# EAGLE schematic foxBMS_BMS-Slave (EAGLE 6.5.0), part 2 of 2
## Sheet 16 of 18: Connectors
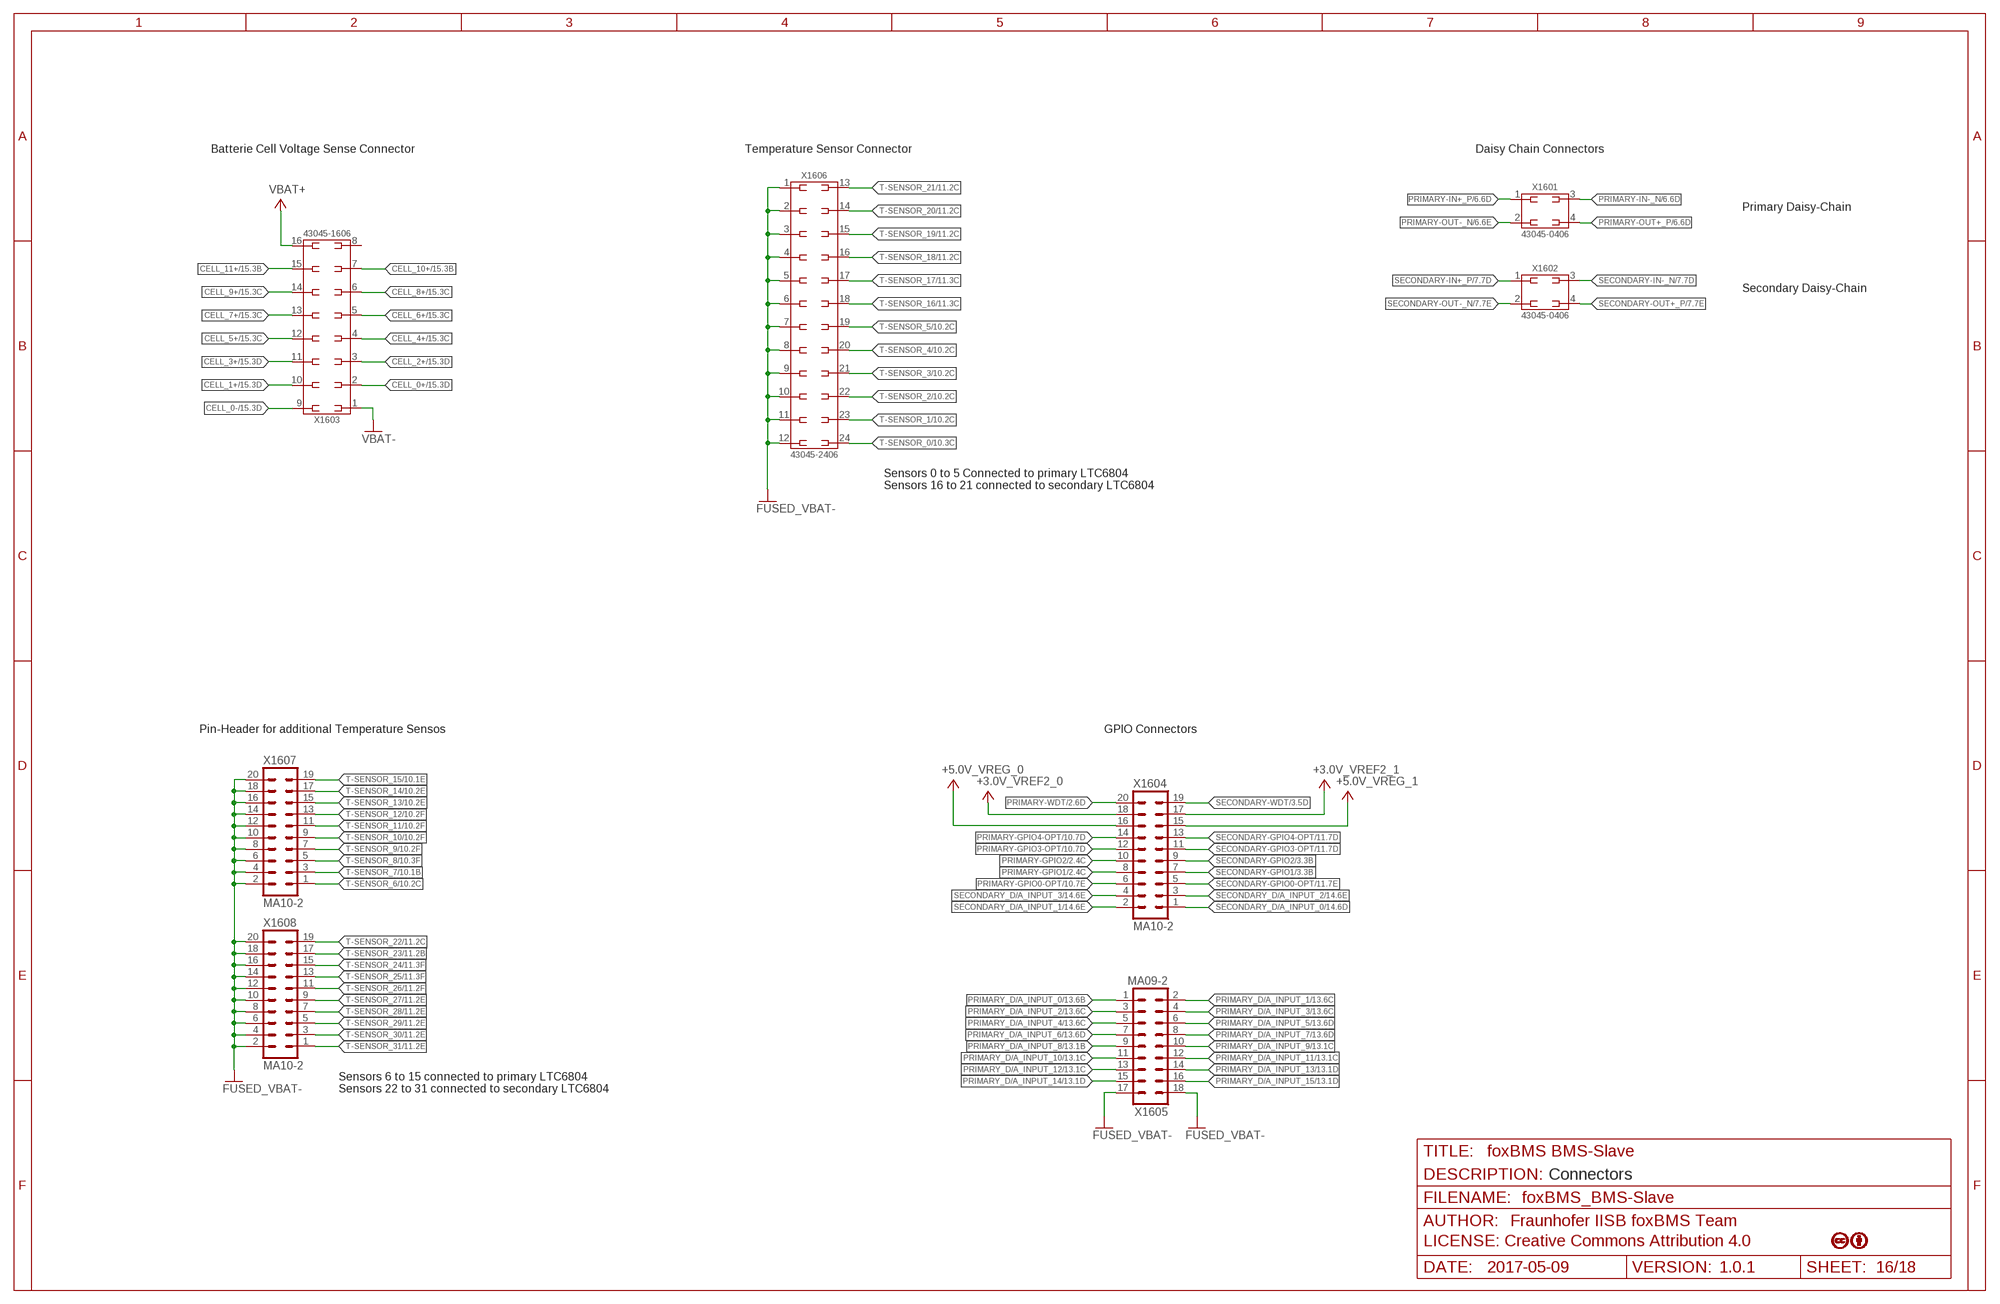
[diagram p16: schematic, sheet 16]

### Parts
X1601  43045-0406_MOLEX_4PIN  [X_SMD_MOLEX_43045-0408_R_REV01]
X1602  43045-0406_MOLEX_4PIN  [X_SMD_MOLEX_43045-0408_R_REV01]
X1603  43045-1606_MOLEX_16PIN  [X_SMD_MOLEX_43045-1608_R_REV01]
X1604  MA10-2  [MA10-2]
X1605  MA09-2  [MA09-2]
X1606  43045-2406_MOLEX_24PIN  [X_SMD_MOLEX_43045-2408_R_REV01]
X1607  MA10-2  [MA10-2]
X1608  MA10-2  [MA10-2]

### Nets
+3.0V_VREF2_0: X1604.18 ; also sheet 2,4,10
+3.0V_VREF2_1: X1604.17 ; also sheet 3,5,11
+5.0V_VREG_0: X1604.16 ; also sheet 2,4,6,10,13,17
+5.0V_VREG_1: X1604.15 ; also sheet 3,5,7,11,14,18
CELL_0+: X1603.2 ; also sheet 15
CELL_0-: X1603.9 ; also sheet 15
CELL_1+: X1603.10 ; also sheet 15
CELL_2+: X1603.3 ; also sheet 15
CELL_3+: X1603.11 ; also sheet 15
CELL_4+: X1603.4 ; also sheet 15
CELL_5+: X1603.12 ; also sheet 15
CELL_6+: X1603.5 ; also sheet 15
CELL_7+: X1603.13 ; also sheet 15
CELL_8+: X1603.6 ; also sheet 15
CELL_9+: X1603.14 ; also sheet 15
CELL_10+: X1603.7 ; also sheet 15
CELL_11+: X1603.15 ; also sheet 15
FUSED_VBAT-: X1605.17 X1605.18 X1606.1 X1606.2 X1606.3 X1606.4 X1606.5 X1606.6 X1606.7 X1606.8 X1606.9 X1606.10 X1606.11 X1606.12 X1607.2 X1607.4 X1607.6 X1607.8 X1607.10 X1607.12 X1607.14 X1607.16 X1607.18 X1607.20 X1608.2 X1608.4 X1608.6 X1608.8 X1608.10 X1608.12 X1608.14 X1608.16 X1608.18 X1608.20 ; also sheet 2,3,4,5,6,7,8,9,10,11,12,13,14,15,17,18
PRIMARY-GPIO0-OPT: X1604.6 ; also sheet 10
PRIMARY-GPIO1: X1604.8 ; also sheet 2
PRIMARY-GPIO2: X1604.10 ; also sheet 2,10
PRIMARY-GPIO3-OPT: X1604.12 ; also sheet 10
PRIMARY-GPIO4-OPT: X1604.14 ; also sheet 10
PRIMARY-IN+_P: X1601.1 ; also sheet 6
PRIMARY-IN-_N: X1601.3 ; also sheet 6
PRIMARY-OUT+_P: X1601.4 ; also sheet 6
PRIMARY-OUT-_N: X1601.2 ; also sheet 6
PRIMARY-WDT: X1604.20 ; also sheet 2,6
PRIMARY_D/A_INPUT_0: X1605.1 ; also sheet 13
PRIMARY_D/A_INPUT_1: X1605.2 ; also sheet 13
PRIMARY_D/A_INPUT_2: X1605.3 ; also sheet 13
PRIMARY_D/A_INPUT_3: X1605.4 ; also sheet 13
PRIMARY_D/A_INPUT_4: X1605.5 ; also sheet 13
PRIMARY_D/A_INPUT_5: X1605.6 ; also sheet 13
PRIMARY_D/A_INPUT_6: X1605.7 ; also sheet 13
PRIMARY_D/A_INPUT_7: X1605.8 ; also sheet 13
PRIMARY_D/A_INPUT_8: X1605.9 ; also sheet 13
PRIMARY_D/A_INPUT_9: X1605.10 ; also sheet 13
PRIMARY_D/A_INPUT_10: X1605.11 ; also sheet 13
PRIMARY_D/A_INPUT_11: X1605.12 ; also sheet 13
PRIMARY_D/A_INPUT_12: X1605.13 ; also sheet 13
PRIMARY_D/A_INPUT_13: X1605.14 ; also sheet 13
PRIMARY_D/A_INPUT_14: X1605.15 ; also sheet 13
PRIMARY_D/A_INPUT_15: X1605.16 ; also sheet 13
SECONDARY-GPIO0-OPT: X1604.5 ; also sheet 11
SECONDARY-GPIO1: X1604.7 ; also sheet 3
SECONDARY-GPIO2: X1604.9 ; also sheet 3,11
SECONDARY-GPIO3-OPT: X1604.11 ; also sheet 11
SECONDARY-GPIO4-OPT: X1604.13 ; also sheet 11
SECONDARY-IN+_P: X1602.1 ; also sheet 7
SECONDARY-IN-_N: X1602.3 ; also sheet 7
SECONDARY-OUT+_P: X1602.4 ; also sheet 7
SECONDARY-OUT-_N: X1602.2 ; also sheet 7
SECONDARY-WDT: X1604.19 ; also sheet 3,7
SECONDARY_D/A_INPUT_0: X1604.1 ; also sheet 14
SECONDARY_D/A_INPUT_1: X1604.2 ; also sheet 14
SECONDARY_D/A_INPUT_2: X1604.3 ; also sheet 14
SECONDARY_D/A_INPUT_3: X1604.4 ; also sheet 14
T-SENSOR_0: X1606.24 ; also sheet 10
T-SENSOR_1: X1606.23 ; also sheet 10
T-SENSOR_2: X1606.22 ; also sheet 10
T-SENSOR_3: X1606.21 ; also sheet 10
T-SENSOR_4: X1606.20 ; also sheet 10
T-SENSOR_5: X1606.19 ; also sheet 10
T-SENSOR_6: X1607.1 ; also sheet 10
T-SENSOR_7: X1607.3 ; also sheet 10
T-SENSOR_8: X1607.5 ; also sheet 10
T-SENSOR_9: X1607.7 ; also sheet 10
T-SENSOR_10: X1607.9 ; also sheet 10
T-SENSOR_11: X1607.11 ; also sheet 10
T-SENSOR_12: X1607.13 ; also sheet 10
T-SENSOR_13: X1607.15 ; also sheet 10
T-SENSOR_14: X1607.17 ; also sheet 10
T-SENSOR_15: X1607.19 ; also sheet 10
T-SENSOR_16: X1606.18 ; also sheet 11
T-SENSOR_17: X1606.17 ; also sheet 11
T-SENSOR_18: X1606.16 ; also sheet 11
T-SENSOR_19: X1606.15 ; also sheet 11
T-SENSOR_20: X1606.14 ; also sheet 11
T-SENSOR_21: X1606.13 ; also sheet 11
T-SENSOR_22: X1608.19 ; also sheet 11
T-SENSOR_23: X1608.17 ; also sheet 11
T-SENSOR_24: X1608.15 ; also sheet 11
T-SENSOR_25: X1608.13 ; also sheet 11
T-SENSOR_26: X1608.11 ; also sheet 11
T-SENSOR_27: X1608.9 ; also sheet 11
T-SENSOR_28: X1608.7 ; also sheet 11
T-SENSOR_29: X1608.5 ; also sheet 11
T-SENSOR_30: X1608.3 ; also sheet 11
T-SENSOR_31: X1608.1 ; also sheet 11
VBAT+: X1603.16 ; also sheet 15
VBAT-: X1603.1 ; also sheet 15
Unconnected: X1603.8

### Notes on the sheet
- Batterie Cell Voltage Sense Connector | Temperature Sensor Connector | Daisy Chain Connectors
- Primary Daisy-Chain
- Secondary Daisy-Chain
- Sensors 0 to 5 Connected to primary LTC6804
  Sensors 16 to 21 connected to secondary LTC6804
- Pin-Header for additional Temperature Sensos | GPIO Connectors
- Sensors 6 to 15 connected to primary LTC6804
  Sensors 22 to 31 connected to secondary LTC6804
- Status: A
- Connectors

## Sheet 17 of 18: Primary EEPROM
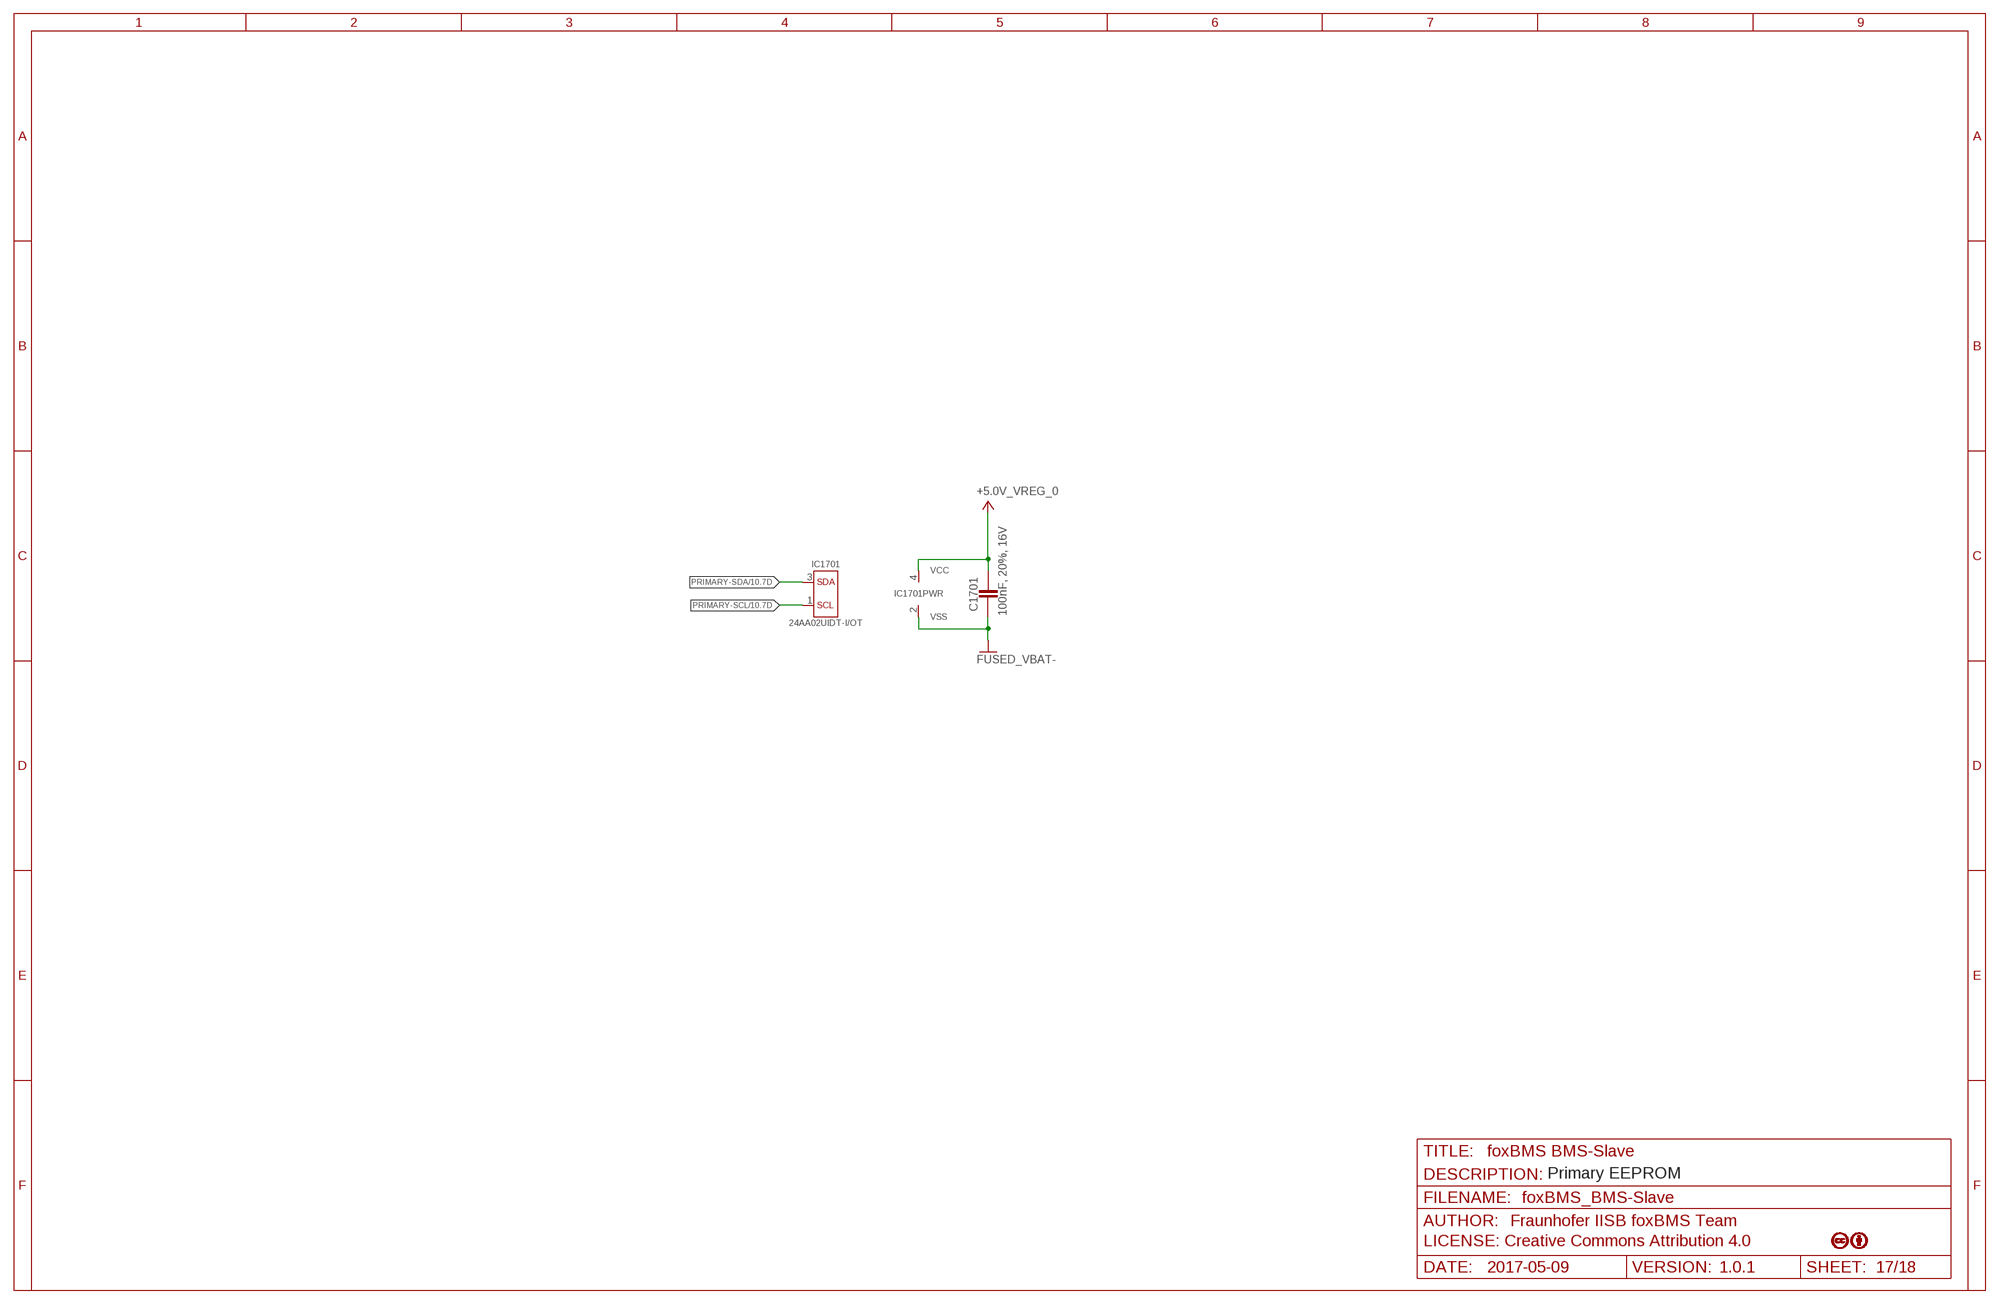
[diagram p17: schematic, sheet 17]

### Parts
C1701  100nF, 20%, 16V  C_NP0_0603  [0603]
IC1701  24AA02UID  [IC_SMD_SOT23-5_R_MICROCHIP_REV01]

### Nets
+5.0V_VREG_0: C1701.2 IC1701.4(VCC) ; also sheet 2,4,6,10,13,16
FUSED_VBAT-: C1701.1 IC1701.2(VSS) ; also sheet 2,3,4,5,6,7,8,9,10,11,12,13,14,15,16,18
PRIMARY-SCL: IC1701.1(SCL) ; also sheet 10,13
PRIMARY-SDA: IC1701.3(SDA) ; also sheet 10,13
Unconnected: IC1701.5(NC)

### Notes on the sheet
- Primary EEPROM

## Sheet 18 of 18: Secondary EEPROM
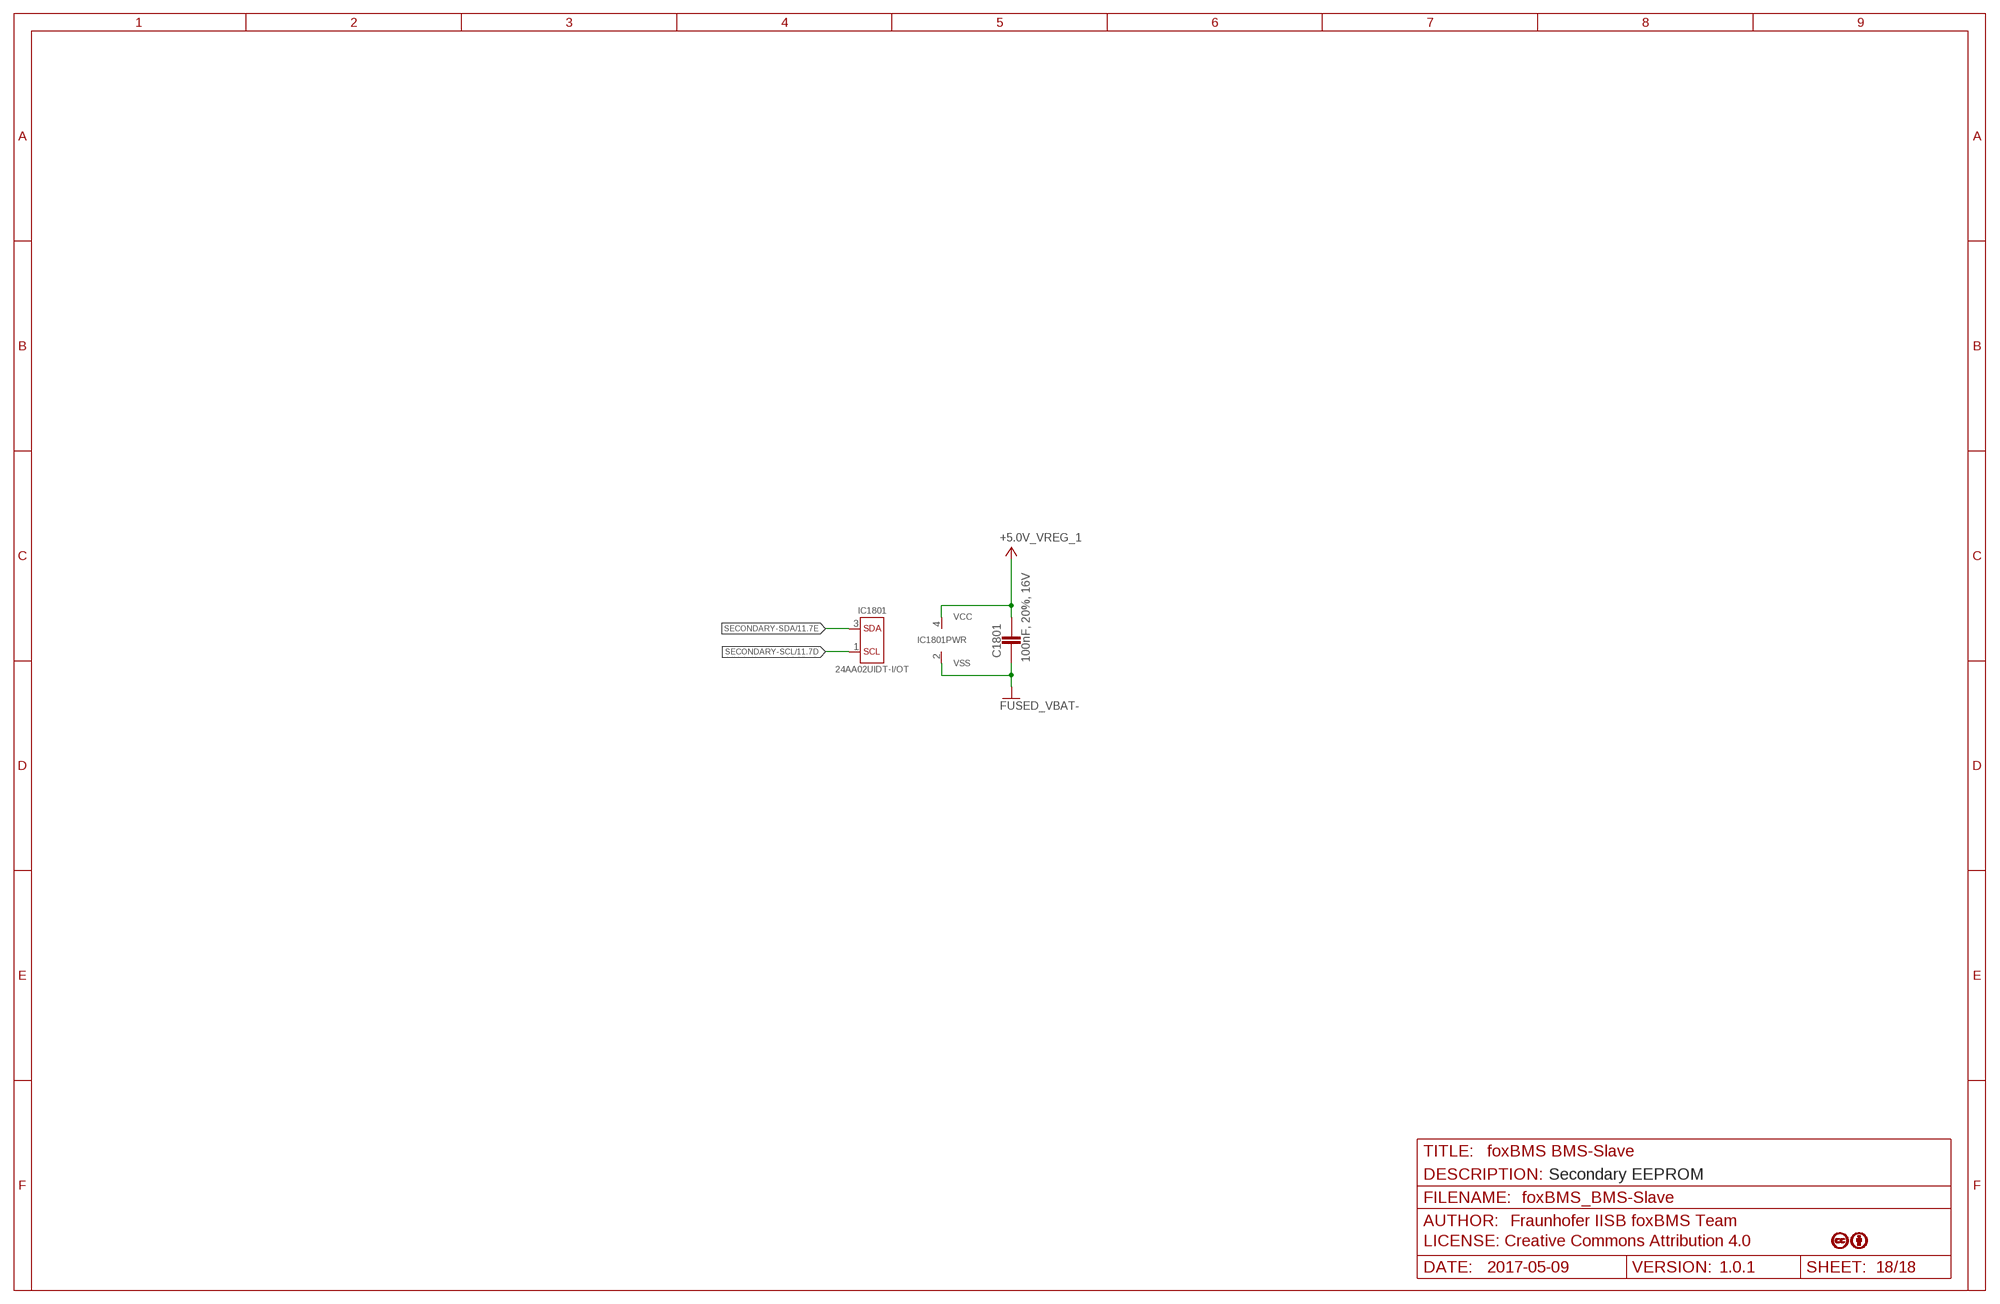
[diagram p18: schematic, sheet 18]

### Parts
C1801  100nF, 20%, 16V  C_NP0_0603  [0603]
IC1801  24AA02UID  [IC_SMD_SOT23-5_R_MICROCHIP_REV01]

### Nets
+5.0V_VREG_1: C1801.2 IC1801.4(VCC) ; also sheet 3,5,7,11,14,16
FUSED_VBAT-: C1801.1 IC1801.2(VSS) ; also sheet 2,3,4,5,6,7,8,9,10,11,12,13,14,15,16,17
SECONDARY-SCL: IC1801.1(SCL) ; also sheet 11,14
SECONDARY-SDA: IC1801.3(SDA) ; also sheet 11,14
Unconnected: IC1801.5(NC)

### Notes on the sheet
- Secondary EEPROM

## Library data of the parts
C401-C406 C501-C506 C601-C604 C701-C704 C801-C826 C901-C926 C1001-C1005 C1101-C1105 C1301 C1302 C1401 C1402 C1701 C1801 = custom_passiv:C*: Kondensator Bitte gleich beim Einfügen vorgesehenen Werkstoff auswählen. 0402 NP0: #2759 0402 X7R: #1977 0402 Y5V: #2761 0603 X7R: #191 0603 Y5V: #497 0805 NP0: #74 0805 X7R: #104 1206 NP0: #102 1206 X7R: #98 1210 X7R: #114 1812 X7R: #335
F1501-F1515 R401 R402 R501 R502 R601-R608 R701-R708 R801-R813 R901-R913 R1001-R1025 R1101-R1125 R1201-R1236 R1301-R1316 R1401-R1429 = custom_passiv:R*: Widerstand: Bitte gleich beim Einfügen vorgesehenen Werkstoff wählen. 0R_0402: #2765 0R_0603: #2227 0R_0805: #2229 Met_0402: #2767 Met_0603: #801 Met_0805: #1095 Met_1206: #1389 Met_MINIMELF: #1683 MET_E96_0402: #2769 MET_E96_0603: #5 MET_E96_0805: #1230 MET_E96_1206: #286 MET_E96_MICROMELF: #1979 MET_E96_MINIMELF: #536
IC201 IC301 = 0_LES_BATTERIE-MANAGEMENT.SMD:LTC6804*G-1: LTC6804-01 - Linear Technology Datasheet www <http://cds.linear.com/docs/en/datasheet/680412fb.pdf> Datasheet local <file:///C:\Eagle-Datasheet\Batterie-Management\LTC6804_Linear.pdf> Multicell Battery Monitors - Measures Up to 12 Battery Cells in Series - Stackable Architecture Supports 100s of Cells - Built-In isoSPI™ Interface: 1Mbps Isolated Serial Communications Uses a Single Twisted Pair, Up to 100 Meters Low EMI Susceptibility and Emissions - 1.2mV Maximum Total Measurement Error - 290μs to Measure All Cells in a System - Synchronized Voltage and Current Measurement - 16-Bit Delta-Sigma ADC with Frequency Programmable 3rd Order Noise Filter - Engineered for ISO26262 Compliant Systems - Passive Cell Balancing with Programmable Timer - 5 General Purpose Digital I/O or Analog Inputs: Temperature or other Sensor Inputs Configurable as an I2C or SPI Master - 4μA Sleep Mode Supply Current - 48-Lead SSOP Package Revision Date changed by Changes ------------------------------------------------------------------------------------------ V1.0 21.04.2016 SC Ersterstellung; DISTRI_1: Digi-Key; DISTRI_1-NR: LTC6804HG-1#PBF-ND; DISTRI_1-PREIS: 18,44€; HERSTELLER: Linear Technology; HERSTELLER-NR: LTC6804HG-1#PBF; MARKING: LTC6804G-1; PDF-LOCAL: file:///C:\Eagle-Datasheet\Batterie-Management\AN84924UA_Panasonic.pdf; SIZE: SSOP-48; UKAT: I; UTERM: Sn; UTMAX: 125°C; UTMIN: -40°C; UTYP: Battery-Management IC; UVAL: LTC6804HG-1#PBF; UVCC_MAX: 55,0V; UVCC_MIN: 11,0V
IC1401-IC1412 = 0_LES_RELAIS.SMD:CPC1008N: CPC1008N - IXYS Datasheet www <http://www.ixysic.com/home/pdfs.nsf/www/CPC1008N.pdf/$file/CPC1008N.pdf> Datasheet local <file:///C:\Eagle-Datasheet\Relais\CPC1008N_IXYS.pdf> Single-Pole, Normally Open - OptoMOS® Relay - SOP-4 - Package - 1500Vrms Input/Output Isolation - Small 4-Pin SOP Package - Low Drive Power Requirements - High Reliability - Arc-Free With No Snubbing Circuits - No EMI/RFI Generation - Wave Solderable - Tape & Reel Version Available Revision Date changed by Changes ------------------------------------------------------------------------------------------ V1.0 01.12.2015 SC Ersterstellung; DISTRI_1: Farnell; DISTRI_1-NR: 2435796; DISTRI_1-PREIS: 1,09€; DISTRI_2: Mouser; DISTRI_2-NR: 926-LM1085ISXADJNOPB; DISTRI_2-PREIS: 1,89€; HERSTELLER: IXYS; HERSTELLER-NR: CPC1008N; MARKING: CPC1008N; PDF-LOCAL: file:///C:\Eagle-Datasheet\Relais\CPC1008N_IXYS.pdf; SIZE: SOP-4; UKAT: I; UPV: 400mW; URISO: 1,50kV; UTERM: Sn; UTMAX: 85°C; UTMIN: -40°C; UTYP: Relay; UVAL: CPC1008N
IC1701 IC1801 = 0_LES_SPEICHER.SMD.EEPROM:24AA02UID: 24AA02UID - Microchip Datasheet www <http://ww1.microchip.com/downloads/en/DeviceDoc/20005202A.pdf> Datasheet local <file:///C:\Eagle-Datasheet\Speicher\24AA02UID_Microchip.pdf> 2K I2C™ Serial EEPROMs with Unique 32-bit Serial Number - Preprogrammed 32-Bit Serial Number: - Unique across all UID-family EEPROMs - Scalable to 48-bit, 64-bit, 128-bit, 256-bit, and other lengths - Single Supply with Operation Down to 1.7V - Low-Power CMOS Technology: - Read current 1 mA, max. - Standby current 1 A, max. - 2-Wire Serial Interface, I2C™ Compatible - Schmitt Trigger Inputs for Noise Suppression - Output Slope Control to Eliminate Ground Bounce - 100 kHz and 400 kHz Clock Compatibility - Page Write Time 3 ms, typical - Self-Timed Erase/Write Cycle - Page Write Buffer: - 8-byte page (24AA02UID) - 16-byte page (24AA025UID) - ESD Protection >4,000V - More than 1 Million Erase/Write Cycles - Data Retention >200 Years - Factory Programming Available - 8-lead PDIP, 8-lead SOIC, and 5-lead SOT-23 (24AA02UID) - 8-lead PDIP, 8-lead SOIC, and 6-lead SOT-23 (24AA025UID) - RoHS Compliant - Temperature Ranges: Industrial (I): -40°C to +85°C Revision Date changed by Changes ------------------------------------------------------------------------------------------ V1.0 24.04.2016 SC Ersterstellung; DISTRI_1: Farnell; DISTRI_1-NR: 2345557; DISTRI_1-PREIS: 0,184€; DISTRI_2: Mouser; DISTRI_2-NR: 579-24AA02UIDT-I/OT; DISTRI_2-PREIS: 0,217€; HERSTELLER: Microchip; HERSTELLER-NR: 24AA02UIDT-I/OT; MARKING: AAAFY; PDF-LOCAL: file:///C:\Eagle-Datasheet\Speicher\24AA02UID_Microchip.pdf; SIZE: SOT23-5; UFREQ: 400kHz; UKAT: I; UPS: 32-Bit; UTERM: Sn; UTMAX: 85°C; UTMIN: -40°C; UTYP: EEPROM; UVAL: 24AA02UIDT-I/OT; UVCC_MAX: 5,50V; UVCC_MIN: 1,70V
LSP401-LSP403 LSP501-LSP503 LSP601-LSP604 LSP701-LSP704 LSP1501-LSP1515 = custom_pad:PAD_: Testpunkte mit und ohne Durchkontaktierung in ver. Größen Nicomatic SMD-Testpunkt
M1001 M1002 M1101 M1102 M1301 M1302 M1401 M1402 = 0_LES_ANALOG.SMD.MUX-DEMUX:LTC1380*?: LTC1380 - Linear Technology Datasheet www <http://cds.linear.com/docs/en/datasheet/138093f.pdf> Datasheet local <file:///C:\Eagle-Datasheet\Analog_MUX\LTC1380-LTC1393_Linear.pdf> Analog Multiplexer/Demultimlexer - Micropower Operation: Supply Current = 20µA Max - 2-Wire SMBus Interface - Single 2.7V to ±5V Supply Operation - Expandable to 32 Single or 16 Differential Channels - Guaranteed Break-Before-Make - Low RON: 35Ω Single Ended/70Ω Differential - Low Charge Injection: 20pC Max - Low Leakage: ±5nA Max - Available in 16-Lead SO and GN Packages Revision Date changed by Changes ------------------------------------------------------------------------------------------ V1.0 21.04.2016 SC Ersterstellung; DISTRI_1: Digi-Key; DISTRI_1-NR: LTC1380CGN#PBF-ND; DISTRI_1-PREIS: 5,94€; HERSTELLER: Linear Technology; HERSTELLER-NR: LTC1380CGN; MARKING: LTC1380CGN; PDF-LOCAL: file:///C:\Eagle-Datasheet\Analog_MUX\LTC1380-LTC1393_Linear.pdf; SIZE: SSOP-16; UKAT: I; ULFS: Lead Free; UPV: 500mW; UTERM: Sn; UTMAX: 70°C; UTMIN: 0°C; UTYP: Multiplexer / Demultiplexer; UVAL: LTC1380CGN; UVCC_MAX: 5,00V; UVCC_MIN: 2,70V
O1001 O1101 = 0_LES_OPERATIONSVERSTAERKER.SMD:LTC6255*?: LTC6255 Serie - Linear Datasheet www <http://cds.linear.com/docs/en/datasheet/625567fd.pdf> Datasheet local <file:///C:\Eagle-Datasheet\Operationsverstaerker\LTC6255-LTC6256-LTC6257_Linear.pdf> 6.5MHz, 65µA Power Efficient Rail-to-Rail I/O Op Amps - Gain Bandwidth Product: 6.5MHz - –3dB Bandwidth (AV = +1): 4.5MHz - Low Quiescent Current: 65µA - C-Load™ Op Amp Drives all Capacitive Loads - Offset Voltage: 350µV Maximum - Rail-to-Rail Input and Output - Supply Voltage Range: 1.8V to 5.25V - Input Bias Current: 50nA Maximum - CMRR/PSRR: 100dB/100dB - Shutdown Current: 7µA Maximum - Operating Temperature Range: –40°C to 125°C - Single in 6-Lead TSOT-23, 2mm × 2mm DFN Packages - Dual in 8-Lead MS8, MS10, TSOT-23, 2mm × 2mm DFN, 2mm × 2mm Thin DFN Packages - Quad in MS16 Package Revision Date changed by Changes ------------------------------------------------------------------------------------------ V1.0 21.04.2016 SC Ersterstellung; DISTRI_1: Digi-Key; DISTRI_1-NR: LTC6255CS6#TRMPBFCT-ND; DISTRI_1-PREIS: 2,70€; HERSTELLER: Linear Technology; HERSTELLER-NR: LTC6255CS6; MARKING: LTFFT; PDF-LOCAL: file:///C:\Eagle-Datasheet\Operationsverstaerker\LTC6255-LTC6256-LTC6257_Linear.pdf; SIZE: TSOT23-6; UBW: 6,50MHz; UKAT: I; UTERM: Sn; UTMAX: 70°C; UTMIN: 0°C; UTYP: Operational Amplifier; UVAL: LTC6255CS6; UVCC_MAX: 5,25V; UVCC_MIN: 1,80V
SJ1001 SJ1101 = custom_jumper:SJ: SMD solder Jumper
SJ1501 SJ1502 = foxBMS_BMS-Master_V1.00_A:SJ: SMD solder JUMPER
T401 T501 = 0_LES_TRANSISTOR.SMD.BJT.NPN:PBHV8115Z: PBHV8115Z - NXP Datasheet www <http://cache.nxp.com/documents/data_sheet/PBHV8115Z.pdf?pspll=1> Datasheet local <file:///C:\Eagle-Datasheet\Transistoren\PBHV8115Z_NXP.pdf> NPN high-voltage low VCEsat (BISS) transistor - High voltage - Low collector-emitter saturation voltage VCEsat - High collector current capability IC and ICMv - High collector current gain (hFE) at high IC - AEC-Q101 qualified - Medium power SMD plastic package Revision Date changed by Changes ------------------------------------------------------------------------------------------ V1.0 21.04.2016 SC Ersterstellung; DISTRI_1: Farnell; DISTRI_1-NR: 1829309; DISTRI_1-PREIS: 0,185€; DISTRI_2: Mouser; DISTRI_2-NR: 771-PBHV8115Z115; DISTRI_2-PREIS: 0,443€; HERSTELLER: NXP; HERSTELLER-NR: PBHV8115Z; MARKING: V8115Z; PDF-LOCAL: file:///C:\Eagle-Datasheet\Transistoren\PBHV8115Z_NXP.pdf; SIZE: SOT-223; UICD_MAX: 1,00A; UKAT: I; UPV: 700mW; UTERM: Sn; UTMAX: 150°C; UTMIN: -55°C; UVAL: PBHV8115Z; UVCB: 400V; UVCE: 150V; UVEB: 6,00V
T1201-T1212 = 0_LES_TRANSISTOR.SMD.MOS.P-KANAL.NO:NX2301P: NX2301P - NXP Datasheet www <http://cache.nxp.com/documents/data_sheet/NX2301P.pdf?pspll=1> Datasheet local <file:///C:\Eagle-Datasheet\Transistoren\NX2301P_NXP.pdf> P-Kanal MOSFET - P-Channel - Enhancement mode - L1.8 V RDSon rated for Low Voltage Gate Drive - AEC-Q101 qualified - Trench MOSFET technology - Very fast switching - SOT23 (TO-236AB) Surface-Mounted Device (SMD) plastic package Revision Date changed by Changes ------------------------------------------------------------------------------------------ V1.0 25.04.2016 SC Ersterstellung; DISTRI_1: Farnell; DISTRI_1-NR: 1894738; DISTRI_1-PREIS: 0,0885€; DISTRI_2: Mouser; DISTRI_2-NR: 771-NX2301P215; DISTRI_2-PREIS: 0,353€; HERSTELLER: NXP; HERSTELLER-NR: NX2301P,215; MARKING: MG*; SIZE: SOT23; UIDMAX: -2,00A; UKAT: I; UPV: 400mW; URDS: 100mOhm; UTERM: Sn; UTMAX: 150°C; UTMIN: -55°C; UTYP: P-Channel MOSFET; UVAL: NXP2301P,215; UVDS: -20,0V; UVGSMAX: 8,00V; UVGSMIN: -8,00V
TR601 TR701 = 0_LES_TRANSFORMER.SMD:HX1188NL: HX1188NL - Pulse Electronic Datasheet www <http://productfinder.pulseeng.com/products/datasheets/HX1188NL.pdf> Datasheet local <file:///C:/Eagle-Datasheet/Transformer/HX1188NL_Pulse.pdf> Ethernet Transformator HX1188NL - Pulse Electronic - Isolierspannung: 1,50kV - Frequenz: 100kHz - 100MHz - Nicht kurzschlussfest - unshielded Revision Date changed by Changes ------------------------------------------------------------------------------------------ V1.0 21.04.2016 SC Ersterstellung; DISTRI_1: Digi-Key; DISTRI_1-NR: 553-1340-ND; DISTRI_1-PREIS: 4,80€; HERSTELLER: Pulse Electronic; HERSTELLER-NR: HX1188NL; MARKING: HX1188NL; PDF-LOCAL: file:///C:/Eagle-Datasheet/Transformer/HX1188NL_Pulse.pdf; SIZE: SOIC-16; UKAT: I; UTERM: Sn; UTMAX: 85°C; UTMIN: -40°C; UTYP: Transformer; UVAL: HX1188NL; UVISO: 1,65kV
X1601 X1602 = 0_LES_STECKVERBINDUNG.SMD.RASTER_3,00MM.BUCHSE:43045-040?*_MOLEX_4PIN: 43045-Serie - MOLEX 43045-0406 Datasheet www <http://www.molex.com/webdocs/datasheets/pdf/en-us/0430450406_PCB_HEADERS.pdf> Datasheet local <file:///C:\Eagle-Datasheet\Steckverbindung\430450406_Molex.pdf> 43045-0407 Datasheet www <http://www.molex.com/webdocs/datasheets/pdf/en-us/0430450407_PCB_HEADERS.pdf> Datasheet local <file:///C:\Eagle-Datasheet\Steckverbindung\430450407_Molex.pdf> 43045-0408 Datasheet www <http://www.molex.com/webdocs/datasheets/pdf/en-us/0430450408_PCB_HEADERS.pdf> Datasheet local <file:///C:\Eagle-Datasheet\Steckverbindung\430450408_Molex.pdf> - 4-Pin Buchse - liegend - Package - 2 reihig x 2-Pins - Size: 15,40mm x 9,65mm x 10,29mm - RM: 3,00mm - Farbe: Schwarz - Material: High Temperature Thermoplastic Revision Date changed by Changes ------------------------------------------------------------------------------------------ V1.0 17.12.2015 SC Ersterstellung; DISTRI_1: Mouser; DISTRI_1-NR: 538-43045-0406; DISTRI_1-PREIS: 2,22€; DISTRI_2: Digi-Key; DISTRI_2-NR: WM3249CT-ND; DISTRI_2-PREIS: 2,34€; HERSTELLER: Molex; HERSTELLER-NR: 43045-0406; PDF-LOCAL: file:///C:\Eagle-Datasheet\Steckverbindung\430450406_Molex.pdf; SIZE: 15,40mm x 6,65mm x 10,29mm; UCOLOR: Schwarz; UIN_MAX: 5,00A; UKAT: C; UMAT: High Temperature Thermoplastic; URISO: 1,00GOhm; UTERM: Sn; UTERMPLAT: 254nm; UTMAX: 105°C; UTMIN: -40°C; UTYP: Buchse; UVAL: 43045-0406; UVCC_MAX: 600V
X1603 = 0_LES_STECKVERBINDUNG.SMD.RASTER_3,00MM.BUCHSE:43045-160?*_MOLEX_16PIN: 43045-Serie - MOLEX 43045-1606 Datasheet www <http://www.molex.com/webdocs/datasheets/pdf/en-us/0430451606_PCB_HEADERS.pdf> Datasheet local <file:///C:\Eagle-Datasheet\Steckverbindung\430451606_Molex.pdf> 43045-1607 Datasheet www <http://www.molex.com/webdocs/datasheets/pdf/en-us/0430451607_PCB_HEADERS.pdf> Datasheet local <file:///C:\Eagle-Datasheet\Steckverbindung\430451607_Molex.pdf> 43045-1608 Datasheet www <http://www.molex.com/webdocs/datasheets/pdf/en-us/0430451608_PCB_HEADERS.pdf> Datasheet local <file:///C:\Eagle-Datasheet\Steckverbindung\430451608_Molex.pdf> - 16-Pin Buchse - liegend - Package - 2 reihig x 8-Pins - Size: 15,40mm x 27,65mm x 10,29mm - RM: 3,00mm - Farbe: Schwarz - Material: High Temperature Thermoplastic Revision Date changed by Changes ------------------------------------------------------------------------------------------ V1.0 17.12.2015 SC Ersterstellung; DISTRI_1: Mouser; DISTRI_1-NR: 538-43045-1606; DISTRI_1-PREIS: 6,70€; DISTRI_2: Digi-Key; DISTRI_2-NR: WM10739CT-ND; DISTRI_2-PREIS: 5,08€; HERSTELLER: Molex; HERSTELLER-NR: 43045-1606; PDF-LOCAL: file:///C:\Eagle-Datasheet\Steckverbindung\430451606_Molex.pdf; SIZE: 15,40mm x 6,65mm x 10,29mm; UCOLOR: Schwarz; UIN_MAX: 5,00A; UKAT: C; UMAT: High Temperature Thermoplastic; URISO: 1,00GOhm; UTERM: Sn; UTERMPLAT: 254nm; UTMAX: 105°C; UTMIN: -40°C; UTYP: Buchse; UVAL: 43045-1606; UVCC_MAX: 600V
X1604 X1607 X1608 = custom_connector:MA10-2: PIN HEADER
X1605 = custom_connector:MA09-2: PIN HEADER
X1606 = 0_LES_STECKVERBINDUNG.SMD.RASTER_3,00MM.BUCHSE:43045-240?*_MOLEX_24PIN: 43045-Serie - MOLEX 43045-2406 Datasheet www <http://www.molex.com/webdocs/datasheets/pdf/en-us/0430452406_PCB_HEADERS.pdf> Datasheet local <file:///C:\Eagle-Datasheet\Steckverbindung\430452406_Molex.pdf> 43045-2407 Datasheet www <http://www.molex.com/webdocs/datasheets/pdf/en-us/0430452407_PCB_HEADERS.pdf> Datasheet local <file:///C:\Eagle-Datasheet\Steckverbindung\430452407_Molex.pdf> 43045-2408 Datasheet www <http://www.molex.com/webdocs/datasheets/pdf/en-us/0430452408_PCB_HEADERS.pdf> Datasheet local <file:///C:\Eagle-Datasheet\Steckverbindung\430452408_Molex.pdf> - 24-Pin Buchse - liegend - Package - 2 reihig x 12-Pins - Size: 15,40mm x 39,65mm x 10,29mm - RM: 3,00mm - Farbe: Schwarz - Material: High Temperature Thermoplastic Revision Date changed by Changes ------------------------------------------------------------------------------------------ V1.0 17.12.2015 SC Ersterstellung; DISTRI_1: Mouser; DISTRI_1-NR: 538-43045-2406; DISTRI_1-PREIS: 8,78€; DISTRI_2: Digi-Key; DISTRI_2-NR: WM10768CT-ND; DISTRI_2-PREIS: 7,02€; HERSTELLER: Molex; HERSTELLER-NR: 43045-2406; PDF-LOCAL: file:///C:\Eagle-Datasheet\Steckverbindung\430452406_Molex.pdf; SIZE: 15,40mm x 6,65mm x 10,29mm; UCOLOR: Schwarz; UIN_MAX: 5,00A; UKAT: C; UMAT: High Temperature Thermoplastic; URISO: 1,00GOhm; UTERM: Sn; UTERMPLAT: 254nm; UTMAX: 105°C; UTMIN: -40°C; UTYP: Buchse; UVAL: 43045-2406; UVCC_MAX: 600V
Z401 Z501 Z801-Z813 Z901-Z913 = 0_LES_DIODE.SMD.ZENER:MMSZ4?: MMSZ4xxxT1G Serie - ON Semiconductor Datasheet www <http://www.onsemi.com/pub_link/Collateral/MMSZ4678T1-D.PDF> Datasheet local <file:///C:\Eagle-Datasheet\Dioden\MMSZ4xxxT1G_OnSemiconductor.pdf> Zener Voltage Regulator - 500 mW Rating on FR−4 or FR−5 Board - Wide Zener Reverse Voltage Range − 1.8 V to 43 V - Package Designed for Optimal Automated Board Assembly - Small Package Size for High Density Applications - ESD Rating of Class 3 (> 16 kV) per Human Body Model) - SOD-123 thermosetting molded plastic package Revision Date changed by Changes ------------------------------------------------------------------------------------------ V1.0 01.01.2014 SC Ersterstellung V1.1 06.11.2014 RW Ausfüllen der Attribute; HERSTELLER: ON Semiconductor; HERSTELLER-NR: DUMMY; PDF-LOCAL: file:///C:\Eagle-Datasheet\Dioden\MMSZ4xxxT1G_OnSemiconductor.pdf; SIZE: SOD-123; TEMP: -55 bis +150°C; UCD: 500mW; UTERM: Sn; UVAL: TBD; UVZ: DUMMY

## Net classes
1 DiffPair: width 0.254 mm